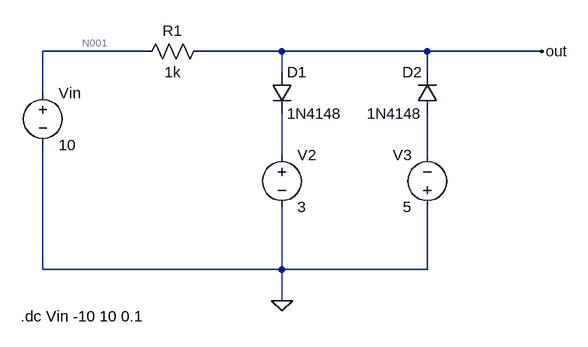
[diagram p0: schematic 2_Zadatak_Lab3.asc]
2_Zadatak_Lab3.asc, the LTspice schematic file:
Version 4
SHEET 1 880 680
WIRE 128 64 -32 64
WIRE 336 64 208 64
WIRE 560 64 336 64
WIRE 736 64 560 64
WIRE 336 96 336 64
WIRE 560 96 560 64
WIRE -32 128 -32 64
WIRE 336 224 336 160
WIRE 560 224 560 160
WIRE -32 400 -32 208
WIRE 336 400 336 304
WIRE 336 400 -32 400
WIRE 560 400 560 304
WIRE 560 400 336 400
WIRE 336 448 336 400
FLAG 336 448 0
FLAG 736 64 out
SYMBOL voltage -32 112 R0
SYMATTR InstName Vin
SYMATTR Value 10
SYMBOL res 224 48 R90
WINDOW 0 0 56 VBottom 2
WINDOW 3 32 56 VTop 2
SYMATTR InstName R1
SYMATTR Value 1k
SYMBOL voltage 336 208 R0
SYMATTR InstName V2
SYMATTR Value 3
SYMBOL voltage 560 320 R180
WINDOW 0 24 96 Left 2
WINDOW 3 24 16 Left 2
SYMATTR InstName V3
SYMATTR Value 5
SYMBOL diode 320 96 R0
SYMATTR InstName D1
SYMATTR Value 1N4148
SYMBOL diode 576 160 R180
WINDOW 0 24 64 Left 2
WINDOW 3 24 0 Left 2
SYMATTR InstName D2
SYMATTR Value 1N4148
TEXT -66 472 Left 2 !.dc Vin -10 10 0.1

The netlist it stands for:
* 2_Zadatak_Lab3.asc
Vin N001 0 10
R1 out N001 1k
V2 N002 0 3
V3 0 N003 5
D1 out N002 1N4148
D2 N003 out 1N4148
.model D D
.lib standard.dio
.dc Vin -10 10 0.1
.backanno
.end

* Results of the author's LTspice run, read from the files saved beside the schematic
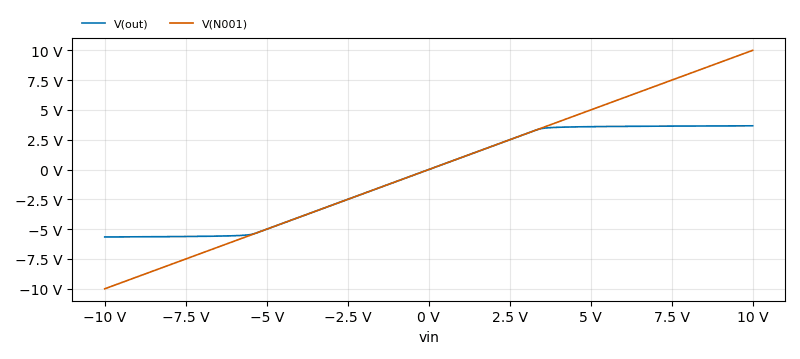
[diagram p1: DC transfer characteristic of 2_Zadatak_Lab3.asc, plotted from the saved traces]
* DC transfer characteristic, 1 run:
*   V(out): -5.653 V at vin=-10 V, 3.671 V at vin=10 V, min -5.653 V, max 3.671 V
*   V(N001): -10 V at vin=-10 V, 10 V at vin=10 V, min -10 V, max 10 V